# Altium project UNO MEDIA CARRIER.PrjPcb (part 1 of 2)
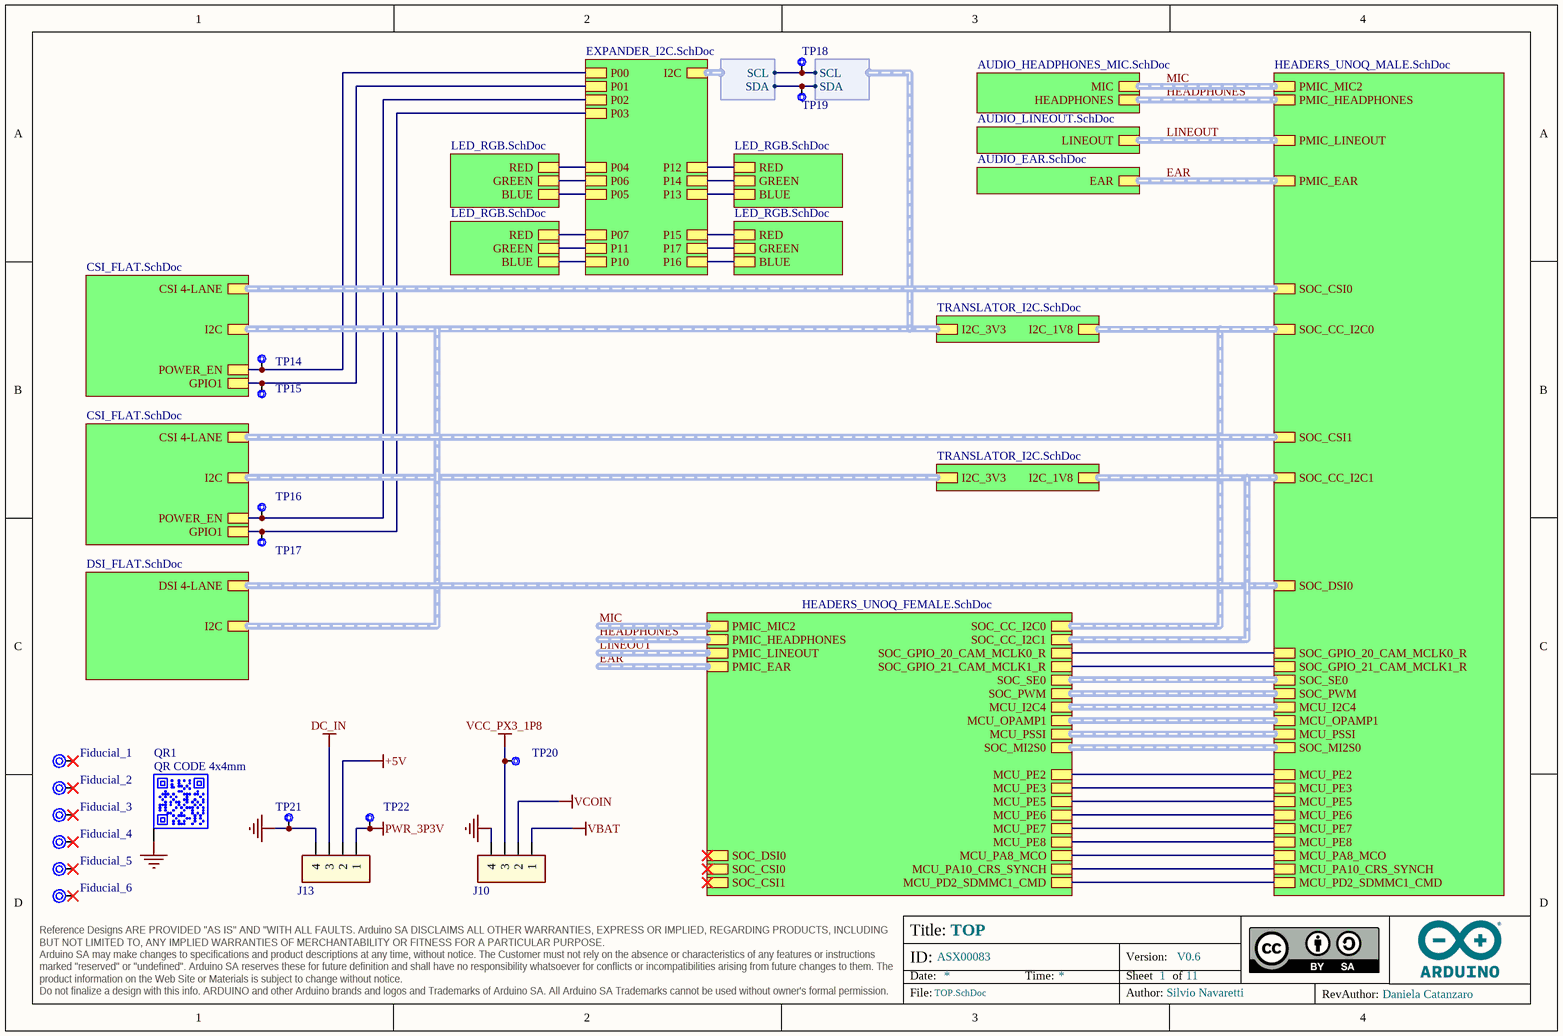
[diagram p0: TOP.SchDoc]
ASSEMBLY_BGA: _; ASSEMBLY_PRESSFIT: _; ASSEMBLY_SMD: X; ASSEMBLY_THT: _; BOARD_CODENAME: UNO Media Carrier; BOARD_INFO_AUTHOR: Silvio Navaretti; BOARD_INFO_AUTHOR_REV: Daniela Catanzaro; BOARD_INFO_Er: _; BOARD_INFO_FLEX: _; BOARD_INFO_FR4: X; BOARD_INFO_FR4_HTG: _; BOARD_INFO_IPC1: _; BOARD_INFO_IPC2: X; BOARD_INFO_IPC3: _; BOARD_INFO_IPC_NA: _; BOARD_INFO_NUMBER_OF_LAYERS: 4; BOARD_INFO_PCB_SIZE: 68.58x53.34mm; BOARD_INFO_POLYMIDE: _; BOARD_INFO_RIGID: X; BOARD_INFO_RIGID/FLEX: _; BOARD_INFO_TBD: _; BOARD_INFO_THICKNESS: 1.6mm; CODENAME: OCIO; DRILLS_BLIND: _; DRILLS_BURIED: _; DRILLS_COPPER_FILLING: _; DRILLS_FULL: X; DRILLS_LASER: _; DRILLS_PRESSFIT: _; DRILLS_RESIN_FILLING: _; DRILLS_SLOT: _; DRILLS_SOLDER_FILLING: X; FINISH_ADJUSTMENTS: _; FINISH_EDGE_PLATING: _; FINISH_ENIG: X; FINISH_HAL: _; FINISH_HAL_LF: -; FINISH_NI/AU: _; FINISH_SILK_BOTTOM: X; FINISH_SILK_COLOR: WHITE; FINISH_SILK_TOP: X; FINISH_SN/PB: _; FINISH_SOLDERMASK_BOTTOM: X; FINISH_SOLDERMASK_COLOR: BLUE; FINISH_SOLDERMASK_PEELABLE_BOTTOM: _; FINISH_SOLDERMASK_PEELABLE_COLOR: _; FINISH_SOLDERMASK_PEELABLE_TOP: _; FINISH_SOLDERMASK_TOP: X; FINISH_TABS: _; FINISH_TBD: _; INSULATION_MIN_INNER: 0.127mm; INSULATION_MIN_OUTER: 0.127mm; PANEL_MILLING: X; PANEL_NOT_REQUESTED: _; PANEL_NUMBER_OF_FIGURES: 8; PANEL_PROVIDED: X; PANEL_REQUESTED: _; PANEL_SCORING: X; PANEL_SIZE: 256x164mm; PANEL_TABS: _; SKU: ASX00083; TRACK_MIN_WIDTH_INNER: 0.127mm; TRACK_MIN_WIDTH_OUTER: 0.127mm; Version: V0.6; VIA_1: _; VIA_1_HOLE_MM: _; VIA_1_PAD_MM: _; VIA_2: _; VIA_2_HOLE_MM: _; VIA_2_PAD_MM: _; VIA_3: _; VIA_3_HOLE_MM: _; VIA_3_PAD_MM: _; VIA_4: _; VIA_4_HOLE_MM: _; VIA_4_PAD_MM: _; VIA_5: _; VIA_5_HOLE_MM: _; VIA_5_PAD_MM: _; VIA_THROUGH: X; VIA_THROUGH_HOLE_MM: 0.3; VIA_THROUGH_PAD_MM: 0.6
11 sheets, 95 parts. Net scope: hierarchical (ports join the sheet entries above them; power ports are global).
Board files: PCB.PcbDoc, PANEL.PcbDoc
Sheets:
  TOP.SchDoc
    U_HEADERS_IMOLA_MALE = HEADERS_UNOQ_MALE.SchDoc
    U_FLAT_CSI = CSI_FLAT.SchDoc
    U_TRANSLATOR_I2C = TRANSLATOR_I2C.SchDoc
    U_FLAT_CSI = CSI_FLAT.SchDoc
    U_TRANSLATOR_I2C = TRANSLATOR_I2C.SchDoc
    U_DSI_FLAT = DSI_FLAT.SchDoc
    U_AUDIO_EAR = AUDIO_EAR.SchDoc
    U_AUDIO_HEADPHONES_MIC = AUDIO_HEADPHONES_MIC.SchDoc
    U_AUDIO_LINEOUT = AUDIO_LINEOUT.SchDoc
    U_HEADERS_IMOLA_FEMALE = HEADERS_UNOQ_FEMALE.SchDoc
    U_Sheet1 = EXPANDER_I2C.SchDoc
    U_LED_RGB_1 = LED_RGB.SchDoc
    U_LED_RGB_2 = LED_RGB.SchDoc
    U_LED_RGB_3 = LED_RGB.SchDoc
    U_LED_RGB_4 = LED_RGB.SchDoc

## Sheet TOP.SchDoc: TOP
size A4; Author: Silvio Navaretti; CompanyName: Arduino SRL; DrawnBy: Silvio Navaretti; Engineer: Silvio Navaretti; Organization: Arduino SRL; DocumentNumber: ASX00083; SheetNumber: 1; SheetTotal: 11; RevAuthor: Silvio Navaretti

### Parts
Fiducial_1  Fiducial mark 1mm with 2mm solder  [Fiducial mark 1mm with circle-Footprint-1]  (value not drawn)  (no BOM)
Fiducial_2  Fiducial mark 1mm with 2mm solder  [Fiducial mark 1mm with circle-Footprint-1]  (value not drawn)  (no BOM)
Fiducial_3  Fiducial mark 1mm with 2mm solder  [Fiducial mark 1mm with circle-Footprint-1]  (value not drawn)  (no BOM)
Fiducial_4  Fiducial mark 1mm with 2mm solder  [Fiducial mark 1mm with circle-Footprint-1]  (value not drawn)  (no BOM)
Fiducial_5  Fiducial mark 1mm with 2mm solder  [Fiducial mark 1mm with circle-Footprint-1]  (value not drawn)  (no BOM)
Fiducial_6  Fiducial mark 1mm with 2mm solder  [Fiducial mark 1mm with circle-Footprint-1]  (value not drawn)  (no BOM)
J10  HEADER TH 2.54mm VERT. 1x004POS  [PIN HEADER 2.54mm VERT. 1x4POS-Footprint-1]  (value not drawn)  (no BOM)
J13  HEADER TH 2.54mm VERT. 1x004POS  [PIN HEADER 2.54mm VERT. 1x4POS-Footprint-1]  (value not drawn)  (no BOM)
QR1  QR CODE 4x4mm  [QR CODE 4x4mm]  (no BOM)
TP14  Test point 1.00mm  [TP-1.00MM]  (value not drawn)  (no BOM)
TP15  Test point 1.00mm  [TP-1.00MM]  (value not drawn)  (no BOM)
TP16  Test point 1.00mm  [TP-1.00MM]  (value not drawn)  (no BOM)
TP17  Test point 1.00mm  [TP-1.00MM]  (value not drawn)  (no BOM)
TP18  Test point 1.00mm  [TP-1.00MM]  (value not drawn)  (no BOM)
TP19  Test point 1.00mm  [TP-1.00MM]  (value not drawn)  (no BOM)
TP20  Test point 1.00mm  [TP-1.00MM]  (value not drawn)  (no BOM)
TP21  Test point 1.00mm  [TP-1.00MM]  (value not drawn)  (no BOM)
TP22  Test point 1.00mm  [TP-1.00MM]  (value not drawn)  (no BOM)

### Sub-sheets
U_AUDIO_EAR = AUDIO_EAR.SchDoc: EAR (harness EAR)
U_AUDIO_HEADPHONES_MIC = AUDIO_HEADPHONES_MIC.SchDoc: MIC (harness MIC), HEADPHONES (harness HEADPHONES)
U_AUDIO_LINEOUT = AUDIO_LINEOUT.SchDoc: LINEOUT (harness LINEOUT)
U_DSI_FLAT = DSI_FLAT.SchDoc: I2C (harness I2C), DSI 4-LANE (harness SOC_GPIO)
U_FLAT_CSI = CSI_FLAT.SchDoc: I2C (harness I2C), CSI 4-LANE (harness IMOLA_CSI), POWER_EN, GPIO1
U_FLAT_CSI = CSI_FLAT.SchDoc: I2C (harness I2C), CSI 4-LANE (harness IMOLA_CSI), POWER_EN, GPIO1
U_HEADERS_IMOLA_FEMALE = HEADERS_UNOQ_FEMALE.SchDoc: SOC_CSI0 (harness IMOLA_CSI), SOC_GPIO_20_CAM_MCLK0_R, SOC_CC_I2C1 (harness I2C), SOC_CSI1 (harness IMOLA_CSI), SOC_GPIO_21_CAM_MCLK1_R, SOC_CC_I2C0 (harness I2C), SOC_DSI0 (harness IMOLA_DSI), MCU_PSSI (harness PSSI_MCU), PMIC_MIC2 (harness MIC), MCU_PD2_SDMMC1_CMD, MCU_I2C4 (harness I2C), MCU_OPAMP1 (harness MCU_OPAMP), PMIC_LINEOUT (harness LINEOUT), PMIC_HEADPHONES (harness HEADPHONES), SOC_PWM (harness SOC_PWM), SOC_SE0 (harness SOC_GPIO), MCU_PA10_CRS_SYNCH, MCU_PA8_MCO, MCU_PE7, MCU_PE8, PMIC_EAR (harness EAT), SOC_MI2S0 (harness SOC_I2S), MCU_PE2, MCU_PE3, MCU_PE5, MCU_PE6
U_HEADERS_IMOLA_MALE = HEADERS_UNOQ_MALE.SchDoc: SOC_CSI0 (harness IMOLA_CSI), SOC_GPIO_20_CAM_MCLK0_R, SOC_CC_I2C1 (harness I2C), SOC_CSI1 (harness IMOLA_CSI), SOC_GPIO_21_CAM_MCLK1_R, SOC_CC_I2C0 (harness I2C), SOC_DSI0 (harness IMOLA_DSI), MCU_PSSI (harness PSSI_MCU), PMIC_MIC2 (harness MIC), MCU_PD2_SDMMC1_CMD, MCU_I2C4 (harness I2C), MCU_OPAMP1 (harness MCU_OPAMP), PMIC_LINEOUT (harness LINEOUT), PMIC_HEADPHONES (harness HEADPHONES), SOC_PWM (harness SOC_PWM), SOC_SE0 (harness SOC_GPIO), MCU_PA10_CRS_SYNCH, MCU_PA8_MCO, MCU_PE7, MCU_PE8, PMIC_EAR (harness EAT), SOC_MI2S0 (harness SOC_I2S), MCU_PE2, MCU_PE3, MCU_PE5, MCU_PE6
U_LED_RGB_1 = LED_RGB.SchDoc: GREEN, BLUE, RED
U_LED_RGB_2 = LED_RGB.SchDoc: GREEN, BLUE, RED
U_LED_RGB_3 = LED_RGB.SchDoc: GREEN, BLUE, RED
U_LED_RGB_4 = LED_RGB.SchDoc: GREEN, BLUE, RED
U_Sheet1 = EXPANDER_I2C.SchDoc: I2C (harness I2C), P00, P01, P02, P03, P04, P05, P06, P07, P10, P11, P12, P13, P14, P15, P16, P17
U_TRANSLATOR_I2C = TRANSLATOR_I2C.SchDoc: I2C_3V3 (harness I2C), I2C_1V8 (harness I2C)
U_TRANSLATOR_I2C = TRANSLATOR_I2C.SchDoc: I2C_3V3 (harness I2C), I2C_1V8 (harness I2C)

### Harnesses
I2C: SDA, SCL

### Nets
+5V: J13.2
DC_IN: J13.3
GND: J10.4 J13.4 QR1.PAD TP21.X
PWR_3P3V: J13.1 TP22.X
VBAT: J10.1
VCC_PX3_1P8: J10.3 TP20.X
VCOIN: J10.2
NetJ3_1_17: TP16.X ; sheet U_FLAT_CSI/POWER_EN, sheet U_Sheet1/P02
NetJ3_1_18: TP17.X ; sheet U_FLAT_CSI/GPIO1, sheet U_Sheet1/P03
NetJ3_2_17: TP14.X ; sheet U_FLAT_CSI/POWER_EN, sheet U_Sheet1/P00
NetJ3_2_18: TP15.X ; sheet U_FLAT_CSI/GPIO1, sheet U_Sheet1/P01
NetJ3_2_20: TP18.X ; sheet U_Sheet1/I2C.SCL, sheet U_FLAT_CSI/I2C.SCL
NetJ3_2_21: TP19.X ; sheet U_Sheet1/I2C.SDA, sheet U_FLAT_CSI/I2C.SDA
NetJ8_16: sheet U_HEADERS_IMOLA_MALE/SOC_GPIO_20_CAM_MCLK0_R, sheet U_HEADERS_IMOLA_FEMALE/SOC_GPIO_20_CAM_MCLK0_R
NetJ8_18: sheet U_HEADERS_IMOLA_MALE/SOC_GPIO_21_CAM_MCLK1_R, sheet U_HEADERS_IMOLA_FEMALE/SOC_GPIO_21_CAM_MCLK1_R
NetJ9_2: sheet U_HEADERS_IMOLA_MALE/MCU_PD2_SDMMC1_CMD, sheet U_HEADERS_IMOLA_FEMALE/MCU_PD2_SDMMC1_CMD
NetJ9_4: sheet U_HEADERS_IMOLA_MALE/MCU_PE2, sheet U_HEADERS_IMOLA_FEMALE/MCU_PE2
NetJ9_6: sheet U_HEADERS_IMOLA_MALE/MCU_PE3, sheet U_HEADERS_IMOLA_FEMALE/MCU_PE3
NetJ9_8: sheet U_HEADERS_IMOLA_MALE/MCU_PE5, sheet U_HEADERS_IMOLA_FEMALE/MCU_PE5
NetJ9_10: sheet U_HEADERS_IMOLA_MALE/MCU_PE6, sheet U_HEADERS_IMOLA_FEMALE/MCU_PE6
NetJ9_12: sheet U_HEADERS_IMOLA_MALE/MCU_PE7, sheet U_HEADERS_IMOLA_FEMALE/MCU_PE7
NetJ9_14: sheet U_HEADERS_IMOLA_MALE/MCU_PE8, sheet U_HEADERS_IMOLA_FEMALE/MCU_PE8
NetJ9_23: sheet U_HEADERS_IMOLA_MALE/MCU_PA8_MCO, sheet U_HEADERS_IMOLA_FEMALE/MCU_PA8_MCO
NetJ9_25: sheet U_HEADERS_IMOLA_MALE/MCU_PA10_CRS_SYNCH, sheet U_HEADERS_IMOLA_FEMALE/MCU_PA10_CRS_SYNCH
NetR2_1_1: sheet U_Sheet1/P04, sheet U_LED_RGB_1/RED
NetR2_2_1: sheet U_Sheet1/P07, sheet U_LED_RGB_2/RED
NetR2_3_1: sheet U_Sheet1/P12, sheet U_LED_RGB_3/RED
NetR2_4_1: sheet U_Sheet1/P15, sheet U_LED_RGB_4/RED
NetR4_1_1: sheet U_Sheet1/P05, sheet U_LED_RGB_1/BLUE
NetR4_2_1: sheet U_Sheet1/P10, sheet U_LED_RGB_2/BLUE
NetR4_3_1: sheet U_Sheet1/P13, sheet U_LED_RGB_3/BLUE
NetR4_4_1: sheet U_Sheet1/P16, sheet U_LED_RGB_4/BLUE
NetR5_1_2: sheet U_Sheet1/P06, sheet U_LED_RGB_1/GREEN
NetR5_2_2: sheet U_Sheet1/P11, sheet U_LED_RGB_2/GREEN
NetR5_3_2: sheet U_Sheet1/P14, sheet U_LED_RGB_3/GREEN
NetR5_4_2: sheet U_Sheet1/P17, sheet U_LED_RGB_4/GREEN

Not connected (* = marked no-connect by the designer): Fiducial_1 1*; Fiducial_2 1*; Fiducial_3 1*; Fiducial_4 1*; Fiducial_5 1*; Fiducial_6 1*

### Buses and harness runs
harness EAR = sheet U_AUDIO_EAR/EAR = sheet U_HEADERS_IMOLA_MALE/PMIC_EAR
harness EAR = sheet U_HEADERS_IMOLA_FEMALE/PMIC_EAR
harness HEADPHONES = sheet U_AUDIO_HEADPHONES_MIC/HEADPHONES = sheet U_HEADERS_IMOLA_MALE/PMIC_HEADPHONES
harness HEADPHONES = sheet U_HEADERS_IMOLA_FEMALE/PMIC_HEADPHONES
harness LINEOUT = sheet U_AUDIO_LINEOUT/LINEOUT = sheet U_HEADERS_IMOLA_MALE/PMIC_LINEOUT
harness LINEOUT = sheet U_HEADERS_IMOLA_FEMALE/PMIC_LINEOUT
harness MIC = sheet U_AUDIO_HEADPHONES_MIC/MIC = sheet U_HEADERS_IMOLA_MALE/PMIC_MIC2
harness MIC = sheet U_HEADERS_IMOLA_FEMALE/PMIC_MIC2
harness sheet U_DSI_FLAT/DSI 4-LANE = sheet U_HEADERS_IMOLA_MALE/SOC_DSI0
harness sheet U_DSI_FLAT/I2C = sheet U_FLAT_CSI/I2C = sheet U_TRANSLATOR_I2C/I2C_3V3
harness sheet U_FLAT_CSI/CSI 4-LANE = sheet U_HEADERS_IMOLA_MALE/SOC_CSI0
harness sheet U_FLAT_CSI/CSI 4-LANE = sheet U_HEADERS_IMOLA_MALE/SOC_CSI1
harness sheet U_FLAT_CSI/I2C = sheet U_TRANSLATOR_I2C/I2C_3V3
harness sheet U_HEADERS_IMOLA_FEMALE/MCU_I2C4 = sheet U_HEADERS_IMOLA_MALE/MCU_I2C4
harness sheet U_HEADERS_IMOLA_FEMALE/MCU_OPAMP1 = sheet U_HEADERS_IMOLA_MALE/MCU_OPAMP1
harness sheet U_HEADERS_IMOLA_FEMALE/MCU_PSSI = sheet U_HEADERS_IMOLA_MALE/MCU_PSSI
harness sheet U_HEADERS_IMOLA_FEMALE/SOC_CC_I2C0 = sheet U_HEADERS_IMOLA_MALE/SOC_CC_I2C0 = sheet U_TRANSLATOR_I2C/I2C_1V8
harness sheet U_HEADERS_IMOLA_FEMALE/SOC_CC_I2C1 = sheet U_HEADERS_IMOLA_MALE/SOC_CC_I2C1 = sheet U_TRANSLATOR_I2C/I2C_1V8
harness sheet U_HEADERS_IMOLA_FEMALE/SOC_MI2S0 = sheet U_HEADERS_IMOLA_MALE/SOC_MI2S0
harness sheet U_HEADERS_IMOLA_FEMALE/SOC_PWM = sheet U_HEADERS_IMOLA_MALE/SOC_PWM
harness sheet U_HEADERS_IMOLA_FEMALE/SOC_SE0 = sheet U_HEADERS_IMOLA_MALE/SOC_SE0

### Notes on the sheet
- Title:
- ID:
- Date:
- Time:
- Version:
- Sheet
- of
- RevAuthor:
- Reference Designs ARE PROVIDED "AS IS" AND "WITH ALL FAULTS. Arduino SA DISCLAIMS ALL OTHER WARRANTIES, EXPRESS OR IMPLIED, REGARDING PRODUCTS, INCLUDING BUT NOT LIMITED TO, ANY IMPLIED WARRANTIES OF MERCHANTABILITY OR FITNESS FOR A PARTICULAR PURPOSE.
  Arduino SA may make changes to specifications and product descriptions at any time, without notice. The Customer must not rely on the absence or characteristics of any features or instructions marked "reserved" or "undefined". Arduino SA reserves these for future definition and shall have no responsibility whatsoever for conflicts or incompatibilities arising from future changes to them. The product information on the Web Site or Materials is subject to change without notice.
  Do not finalize a design with this info. ARDUINO and other Arduino brands and logos and Trademarks of Arduino SA. All Arduino SA Trademarks cannot be used without owner's formal permission.
- File:
- Author:

### Library data of the parts
Fiducial_1-Fiducial_6 = UT0024-A.6
J10 J13 = J0162-A.6: Code Arduino: J0162
QR1 = QR-0001-A.5: QR CODE 4x4mm on layer 34 (This is not a component); Code Arduino: QRCODE_4x4mm; Part Number: This is not a component; Manufacturer: This is not a component
TP14-TP22 = UT0013-A.6: Manufacturer: This is not a component; Source: ut.SchLib; Pin Count: 1; Design Item ID: CMP-018-0005-A.3; Part Number: This is not a component; Code Arduino: This is not a component

## Sheet HEADERS_UNOQ_MALE.SchDoc: HEADERS UNO Q MALE
size A3; Author: Silvio Navaretti; CompanyName: Arduino SRL; DrawnBy: Silvio Navaretti; Engineer: Silvio Navaretti; Organization: Arduino SRL; DocumentNumber: ASX00083; SheetNumber: 2; SheetTotal: 11; RevAuthor: Silvio Navaretti
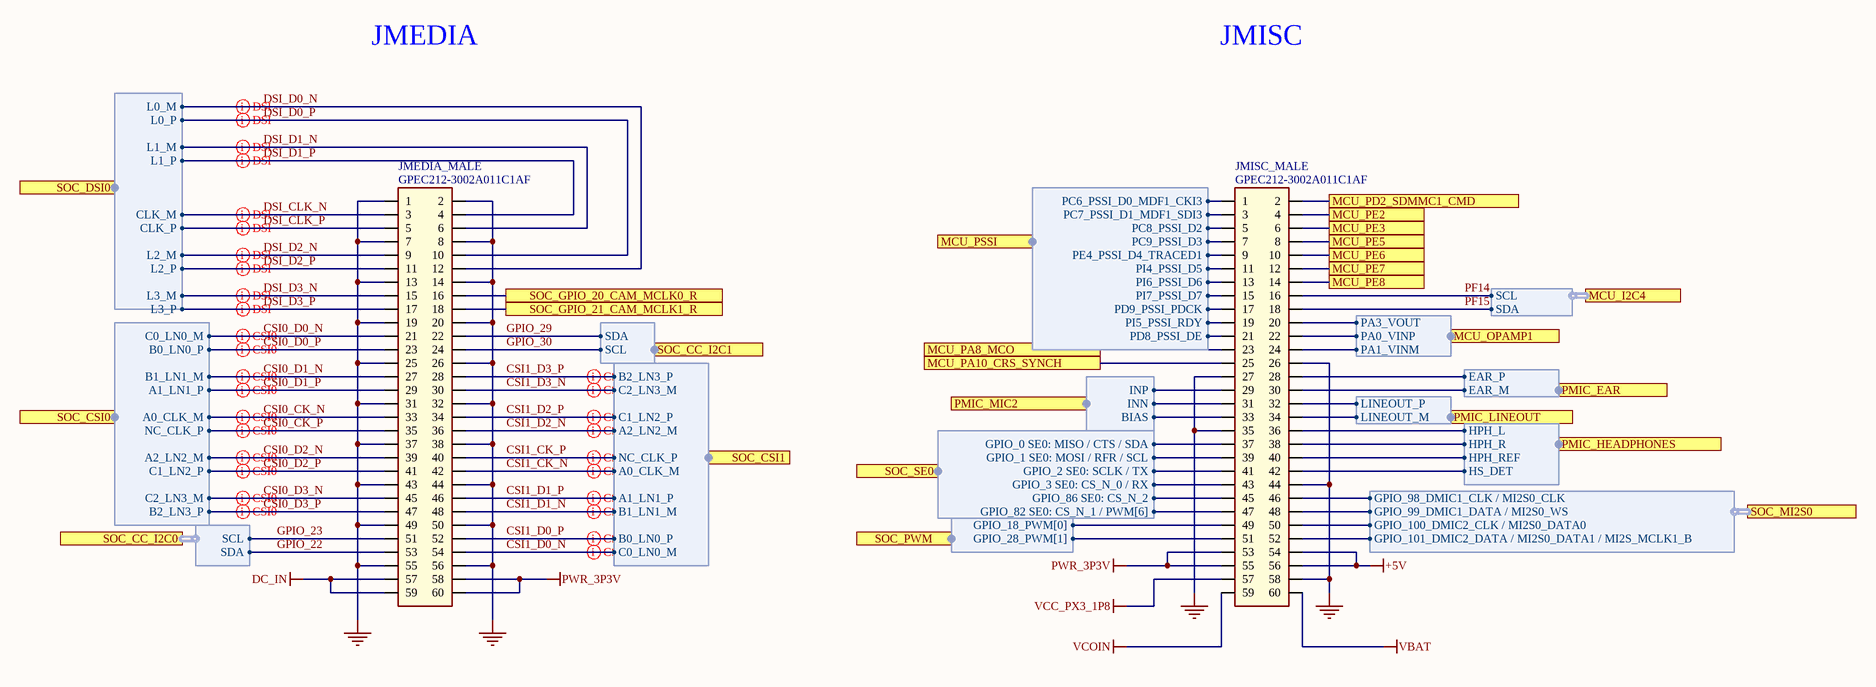
[diagram p1: HEADERS_UNOQ_MALE.SchDoc]

### Parts
JMEDIA_MALE  GPEC212-3002A011C1AF  [GPEC212-3002A011C1AF]
JMISC_MALE  GPEC212-3002A011C1AF  [GPEC212-3002A011C1AF]

### Ports
MCU_I2C4 (harness I2C), MCU_OPAMP1 (harness MCU_OPAMP), MCU_PA8_MCO, MCU_PA10_CRS_SYNCH, MCU_PD2_SDMMC1_CMD, MCU_PE2, MCU_PE3, MCU_PE5, MCU_PE6, MCU_PE7, MCU_PE8, MCU_PSSI (harness PSSI_MCU), PMIC_EAR (harness EAT), PMIC_HEADPHONES (harness HEADPHONES), PMIC_LINEOUT (harness LINEOUT), PMIC_MIC2 (harness MIC), SOC_CC_I2C0 (harness I2C), SOC_CC_I2C1 (harness I2C), SOC_CSI0 (harness IMOLA_CSI), SOC_CSI1 (harness IMOLA_CSI), SOC_DSI0 (harness IMOLA_DSI), SOC_GPIO_20_CAM_MCLK0_R, SOC_GPIO_21_CAM_MCLK1_R, SOC_MI2S0 (harness SOC_I2S), SOC_PWM (harness SOC_PWM), SOC_SE0 (harness SOC_GPIO)

### Harnesses
IMOLA_DSI: L1_P, L1_M, L3_P, L3_M, CLK_P, CLK_M, L0_P, L0_M, L2_P, L2_M
I2C: SDA, SCL
IMOLA_CSI: C2_LN3_M, A2_LN2_M, C1_LN2_P, C0_LN0_M, B0_LN0_P, A0_CLK_M, NC_CLK_P, B1_LN1_M, A1_LN1_P, B2_LN3_P
PSSI_MCU: PC6_PSSI_D0_MDF1_CKI3, PC7_PSSI_D1_MDF1_SDI3, PC8_PSSI_D2, PC9_PSSI_D3, PE4_PSSI_D4_TRACED1, PI4_PSSI_D5, PI6_PSSI_D6, PI7_PSSI_D7, PD9_PSSI_PDCK, PI5_PSSI_RDY, PD8_PSSI_DE
MCU_OPAMP: PA3_VOUT, PA0_VINP, PA1_VINM
EAT: EAR_P, EAR_M
MIC: INP, INN, BIAS
LINEOUT: LINEOUT_P, LINEOUT_M
HEADPHONES: HPH_L, HPH_R, HPH_REF, HS_DET
SOC_GPIO: GPIO_0 SE0: MISO / CTS / SDA, GPIO_1 SE0: MOSI / RFR / SCL, GPIO_2 SE0: SCLK / TX, GPIO_3 SE0: CS_N_0 / RX, GPIO_86 SE0: CS_N_2, GPIO_82 SE0: CS_N_1 / PWM[6]
SOC_I2S: GPIO_98_DMIC1_CLK / MI2S0_CLK, GPIO_99_DMIC1_DATA / MI2S0_WS, GPIO_100_DMIC2_CLK / MI2S0_DATA0, GPIO_101_DMIC2_DATA / MI2S0_DATA1 / MI2S_MCLK1_B
SOC_PWM: GPIO_18_PWM[0], GPIO_28_PWM[1]

### Nets
+5V: JMISC_MALE.54 JMISC_MALE.56
DC_IN: JMEDIA_MALE.57 JMEDIA_MALE.59
GND: JMEDIA_MALE.1 JMEDIA_MALE.2 JMEDIA_MALE.7 JMEDIA_MALE.8 JMEDIA_MALE.13 JMEDIA_MALE.14 JMEDIA_MALE.19 JMEDIA_MALE.20 JMEDIA_MALE.25 JMEDIA_MALE.26 JMEDIA_MALE.31 JMEDIA_MALE.32 JMEDIA_MALE.37 JMEDIA_MALE.38 JMEDIA_MALE.43 JMEDIA_MALE.44 JMEDIA_MALE.49 JMEDIA_MALE.50 JMEDIA_MALE.55 JMEDIA_MALE.56 JMISC_MALE.26 JMISC_MALE.27 JMISC_MALE.31 JMISC_MALE.35 JMISC_MALE.40 JMISC_MALE.44 JMISC_MALE.58 ; port PMIC_MIC2.INN, port PMIC_HEADPHONES.HPH_REF
PWR_3P3V: JMEDIA_MALE.58 JMEDIA_MALE.60 JMISC_MALE.53 JMISC_MALE.55
VBAT: JMISC_MALE.60
VCC_PX3_1P8: JMISC_MALE.57
VCOIN: JMISC_MALE.59
CSI0_CK_N: JMEDIA_MALE.33 ; port SOC_CSI0.A0_CLK_M
CSI0_CK_P: JMEDIA_MALE.35 ; port SOC_CSI0.NC_CLK_P
CSI0_D0_N: JMEDIA_MALE.21 ; port SOC_CSI0.C0_LN0_M
CSI0_D0_P: JMEDIA_MALE.23 ; port SOC_CSI0.B0_LN0_P
CSI0_D1_N: JMEDIA_MALE.27 ; port SOC_CSI0.B1_LN1_M
CSI0_D1_P: JMEDIA_MALE.29 ; port SOC_CSI0.A1_LN1_P
CSI0_D2_N: JMEDIA_MALE.39 ; port SOC_CSI0.A2_LN2_M
CSI0_D2_P: JMEDIA_MALE.41 ; port SOC_CSI0.C1_LN2_P
CSI0_D3_N: JMEDIA_MALE.45 ; port SOC_CSI0.C2_LN3_M
CSI0_D3_P: JMEDIA_MALE.47 ; port SOC_CSI0.B2_LN3_P
CSI1_CK_N: JMEDIA_MALE.42 ; port SOC_CSI1.A0_CLK_M
CSI1_CK_P: JMEDIA_MALE.40 ; port SOC_CSI1.NC_CLK_P
CSI1_D0_N: JMEDIA_MALE.54 ; port SOC_CSI1.C0_LN0_M
CSI1_D0_P: JMEDIA_MALE.52 ; port SOC_CSI1.B0_LN0_P
CSI1_D1_N: JMEDIA_MALE.48 ; port SOC_CSI1.B1_LN1_M
CSI1_D1_P: JMEDIA_MALE.46 ; port SOC_CSI1.A1_LN1_P
CSI1_D2_N: JMEDIA_MALE.36 ; port SOC_CSI1.A2_LN2_M
CSI1_D2_P: JMEDIA_MALE.34 ; port SOC_CSI1.C1_LN2_P
CSI1_D3_N: JMEDIA_MALE.30 ; port SOC_CSI1.C2_LN3_M
CSI1_D3_P: JMEDIA_MALE.28 ; port SOC_CSI1.B2_LN3_P
DSI_CLK_N: JMEDIA_MALE.3 ; port SOC_DSI0.CLK_M
DSI_CLK_P: JMEDIA_MALE.5 ; port SOC_DSI0.CLK_P
DSI_D0_N: JMEDIA_MALE.12 ; port SOC_DSI0.L0_M
DSI_D0_P: JMEDIA_MALE.10 ; port SOC_DSI0.L0_P
DSI_D1_N: JMEDIA_MALE.6 ; port SOC_DSI0.L1_M
DSI_D1_P: JMEDIA_MALE.4 ; port SOC_DSI0.L1_P
DSI_D2_N: JMEDIA_MALE.9 ; port SOC_DSI0.L2_M
DSI_D2_P: JMEDIA_MALE.11 ; port SOC_DSI0.L2_P
DSI_D3_N: JMEDIA_MALE.15 ; port SOC_DSI0.L3_M
DSI_D3_P: JMEDIA_MALE.17 ; port SOC_DSI0.L3_P
EAR.EAR_M: JMISC_MALE.30 ; port PMIC_EAR.EAR_M
EAR.EAR_P: JMISC_MALE.28 ; port PMIC_EAR.EAR_P
GPIO_22: JMEDIA_MALE.53 ; port SOC_CC_I2C0.SDA
GPIO_23: JMEDIA_MALE.51 ; port SOC_CC_I2C0.SCL
GPIO_29: JMEDIA_MALE.22 ; port SOC_CC_I2C1.SDA
GPIO_30: JMEDIA_MALE.24 ; port SOC_CC_I2C1.SCL
HEADPHONES.HPH_L: JMISC_MALE.36 ; port PMIC_HEADPHONES.HPH_L
HEADPHONES.HPH_R: JMISC_MALE.38 ; port PMIC_HEADPHONES.HPH_R
HEADPHONES.HS_DET: JMISC_MALE.42 ; port PMIC_HEADPHONES.HS_DET
LINEOUT.LINEOUT_M: JMISC_MALE.34 ; port PMIC_LINEOUT.LINEOUT_M
LINEOUT.LINEOUT_P: JMISC_MALE.32 ; port PMIC_LINEOUT.LINEOUT_P
MIC.BIAS: JMISC_MALE.33 ; port PMIC_MIC2.BIAS
MIC.INP: JMISC_MALE.29 ; port PMIC_MIC2.INP
PF14: JMISC_MALE.16 ; port MCU_I2C4.SCL
PF15: JMISC_MALE.18 ; port MCU_I2C4.SDA
NetJ8_16: JMEDIA_MALE.16 ; port SOC_GPIO_20_CAM_MCLK0_R
NetJ8_18: JMEDIA_MALE.18 ; port SOC_GPIO_21_CAM_MCLK1_R
NetJ9_1: JMISC_MALE.1 ; port MCU_PSSI.PC6_PSSI_D0_MDF1_CKI3
NetJ9_2: JMISC_MALE.2 ; port MCU_PD2_SDMMC1_CMD
NetJ9_3: JMISC_MALE.3 ; port MCU_PSSI.PC7_PSSI_D1_MDF1_SDI3
NetJ9_4: JMISC_MALE.4 ; port MCU_PE2
NetJ9_5: JMISC_MALE.5 ; port MCU_PSSI.PC8_PSSI_D2
NetJ9_6: JMISC_MALE.6 ; port MCU_PE3
NetJ9_7: JMISC_MALE.7 ; port MCU_PSSI.PC9_PSSI_D3
NetJ9_8: JMISC_MALE.8 ; port MCU_PE5
NetJ9_9: JMISC_MALE.9 ; port MCU_PSSI.PE4_PSSI_D4_TRACED1
NetJ9_10: JMISC_MALE.10 ; port MCU_PE6
NetJ9_11: JMISC_MALE.11 ; port MCU_PSSI.PI4_PSSI_D5
NetJ9_12: JMISC_MALE.12 ; port MCU_PE7
NetJ9_13: JMISC_MALE.13 ; port MCU_PSSI.PI6_PSSI_D6
NetJ9_14: JMISC_MALE.14 ; port MCU_PE8
NetJ9_15: JMISC_MALE.15 ; port MCU_PSSI.PI7_PSSI_D7
NetJ9_17: JMISC_MALE.17 ; port MCU_PSSI.PD9_PSSI_PDCK
NetJ9_19: JMISC_MALE.19 ; port MCU_PSSI.PI5_PSSI_RDY
NetJ9_20: JMISC_MALE.20 ; port MCU_OPAMP1.PA3_VOUT
NetJ9_21: JMISC_MALE.21 ; port MCU_PSSI.PD8_PSSI_DE
NetJ9_22: JMISC_MALE.22 ; port MCU_OPAMP1.PA0_VINP
NetJ9_23: JMISC_MALE.23 ; port MCU_PA8_MCO
NetJ9_24: JMISC_MALE.24 ; port MCU_OPAMP1.PA1_VINM
NetJ9_25: JMISC_MALE.25 ; port MCU_PA10_CRS_SYNCH
NetJ9_37: JMISC_MALE.37 ; port SOC_SE0.GPIO_0 SE0: MISO / CTS / SDA
NetJ9_39: JMISC_MALE.39 ; port SOC_SE0.GPIO_1 SE0: MOSI / RFR / SCL
NetJ9_41: JMISC_MALE.41 ; port SOC_SE0.GPIO_2 SE0: SCLK / TX
NetJ9_43: JMISC_MALE.43 ; port SOC_SE0.GPIO_3 SE0: CS_N_0 / RX
NetJ9_45: JMISC_MALE.45 ; port SOC_SE0.GPIO_86 SE0: CS_N_2
NetJ9_46: JMISC_MALE.46 ; port SOC_MI2S0.GPIO_98_DMIC1_CLK / MI2S0_CLK
NetJ9_47: JMISC_MALE.47 ; port SOC_SE0.GPIO_82 SE0: CS_N_1 / PWM[6]
NetJ9_48: JMISC_MALE.48 ; port SOC_MI2S0.GPIO_99_DMIC1_DATA / MI2S0_WS
NetJ9_49: JMISC_MALE.49 ; port SOC_PWM.GPIO_18_PWM[0]
NetJ9_50: JMISC_MALE.50 ; port SOC_MI2S0.GPIO_100_DMIC2_CLK / MI2S0_DATA0
NetJ9_51: JMISC_MALE.51 ; port SOC_PWM.GPIO_28_PWM[1]
NetJ9_52: JMISC_MALE.52 ; port SOC_MI2S0.GPIO_101_DMIC2_DATA / MI2S0_DATA1 / MI2S_MCLK1_B

### Layout directives
differential pair; differential pair class DSI; net class IMPEDANCE_100R: DSI_CLK_N, DSI_CLK_P, DSI_D0_N, DSI_D0_P, DSI_D1_N, DSI_D1_P, DSI_D2_N, DSI_D2_P, DSI_D3_N, DSI_D3_P
differential pair; differential pair class CSI0; net class IMPEDANCE_100R: CSI0_CK_N, CSI0_CK_P, CSI0_D0_N, CSI0_D0_P, CSI0_D1_N, CSI0_D1_P, CSI0_D2_N, CSI0_D2_P, CSI0_D3_N, CSI0_D3_P
differential pair; differential pair class CSI1; net class IMPEDANCE_100R: CSI1_CK_N, CSI1_CK_P, CSI1_D0_N, CSI1_D0_P, CSI1_D1_N, CSI1_D1_P, CSI1_D2_N, CSI1_D2_P, CSI1_D3_N, CSI1_D3_P

### Notes on the sheet
- JMEDIA
- JMISC
- Title:
- ID:
- Date:
- Time:
- Version:
- Sheet
- of
- RevAuthor:
- Reference Designs ARE PROVIDED "AS IS" AND "WITH ALL FAULTS. Arduino SA DISCLAIMS ALL OTHER WARRANTIES, EXPRESS OR IMPLIED, REGARDING PRODUCTS, INCLUDING BUT NOT LIMITED TO, ANY IMPLIED WARRANTIES OF MERCHANTABILITY OR FITNESS FOR A PARTICULAR PURPOSE.
  Arduino SA may make changes to specifications and product descriptions at any time, without notice. The Customer must not rely on the absence or characteristics of any features or instructions marked "reserved" or "undefined".
  Arduino SA reserves these for future definition and shall have no responsibility whatsoever for conflicts or incompatibilities arising from future changes to them. The product information on the Web Site or Materials is subject to change without notice.
  Do not finalize a design with this info. ARDUINO and other Arduino brands and logos and Trademarks of Arduino SA. All Arduino SA Trademarks cannot be used without owner's formal permission.
- File:
- Author:

### Library data of the parts
JMEDIA_MALE JMISC_MALE = J0568-A.3: CONN HEADER MALE VERTICAL SMD 1.27mm 2x30 POS lead heigth 3.5mm; Manufacturer: Greenconn; Code Arduino: J0568; Part Number: GPEC212-3002A011C1AF

## Sheet CSI_FLAT.SchDoc: CSI FLAT
size A4; Author: Silvio Navaretti; CompanyName: Arduino SRL; DrawnBy: Silvio Navaretti; Engineer: Silvio Navaretti; Organization: Arduino SRL; DocumentNumber: ASX00083; SheetNumber: 6; SheetTotal: 11; RevAuthor: Silvio Navaretti
Used 2 times, as channels U_FLAT_CSI, U_FLAT_CSI. Parts and nets are listed once, with the designators drawn on the sheet.
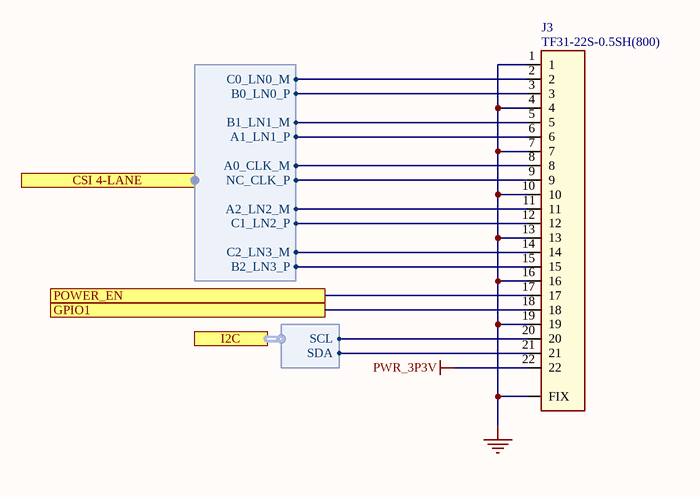
[diagram p2: CSI_FLAT.SchDoc]

### Parts
J3  TF31-22S-0.5SH(800)  [TF31-22S-0.5SH(800)]

### Ports
CSI 4-LANE (harness IMOLA_CSI), GPIO1, I2C (harness I2C), POWER_EN

### Harnesses
I2C: SDA, SCL
IMOLA_CSI: C2_LN3_M, A2_LN2_M, C1_LN2_P, C0_LN0_M, B0_LN0_P, A0_CLK_M, NC_CLK_P, B1_LN1_M, A1_LN1_P, B2_LN3_P

### Nets
GND: J3.1 J3.4 J3.7 J3.10 J3.13 J3.16 J3.19 J3.FIX
PWR_3P3V: J3.22
GPIO1: J3.18 ; port GPIO1
POWER_EN: J3.17 ; port POWER_EN
NetJ3_2: J3.2 ; port CSI 4-LANE.C0_LN0_M
NetJ3_3: J3.3 ; port CSI 4-LANE.B0_LN0_P
NetJ3_5: J3.5 ; port CSI 4-LANE.B1_LN1_M
NetJ3_6: J3.6 ; port CSI 4-LANE.A1_LN1_P
NetJ3_8: J3.8 ; port CSI 4-LANE.A0_CLK_M
NetJ3_9: J3.9 ; port CSI 4-LANE.NC_CLK_P
NetJ3_11: J3.11 ; port CSI 4-LANE.A2_LN2_M
NetJ3_12: J3.12 ; port CSI 4-LANE.C1_LN2_P
NetJ3_14: J3.14 ; port CSI 4-LANE.C2_LN3_M
NetJ3_15: J3.15 ; port CSI 4-LANE.B2_LN3_P
NetJ3_20: J3.20 ; port I2C.SCL
NetJ3_21: J3.21 ; port I2C.SDA

### Channels
U_FLAT_CSI: designators end in _2; ports GPIO1=NetJ3_2_18 POWER_EN=NetJ3_2_17
U_FLAT_CSI: designators end in _1; ports GPIO1=NetJ3_1_18 POWER_EN=NetJ3_1_17

### Library data of the parts
J3 = J0553-A.2: CONN FFC/FPC Connector, 22 Contact(s), 1 Row(s), BOTTOM CONTACT, Female, Right Angle, 0.5mm Pitch; Manufacturer: Hirose; Code Arduino: J0553; Part Number: TF31-22S-0.5SH(800)

## Sheet TRANSLATOR_I2C.SchDoc: TRANSLATOR I2C
size A4; Author: Silvio Navaretti; CompanyName: ARDUINO SRL; DrawnBy: Silvio Navaretti; Engineer: Silvio Navaretti; Organization: ARDUINO SRL; DocumentNumber: ASX00083; SheetNumber: 4; SheetTotal: 11; RevAuthor: Silvio Navaretti
Used 2 times, as channels U_TRANSLATOR_I2C, U_TRANSLATOR_I2C. Parts and nets are listed once, with the designators drawn on the sheet.
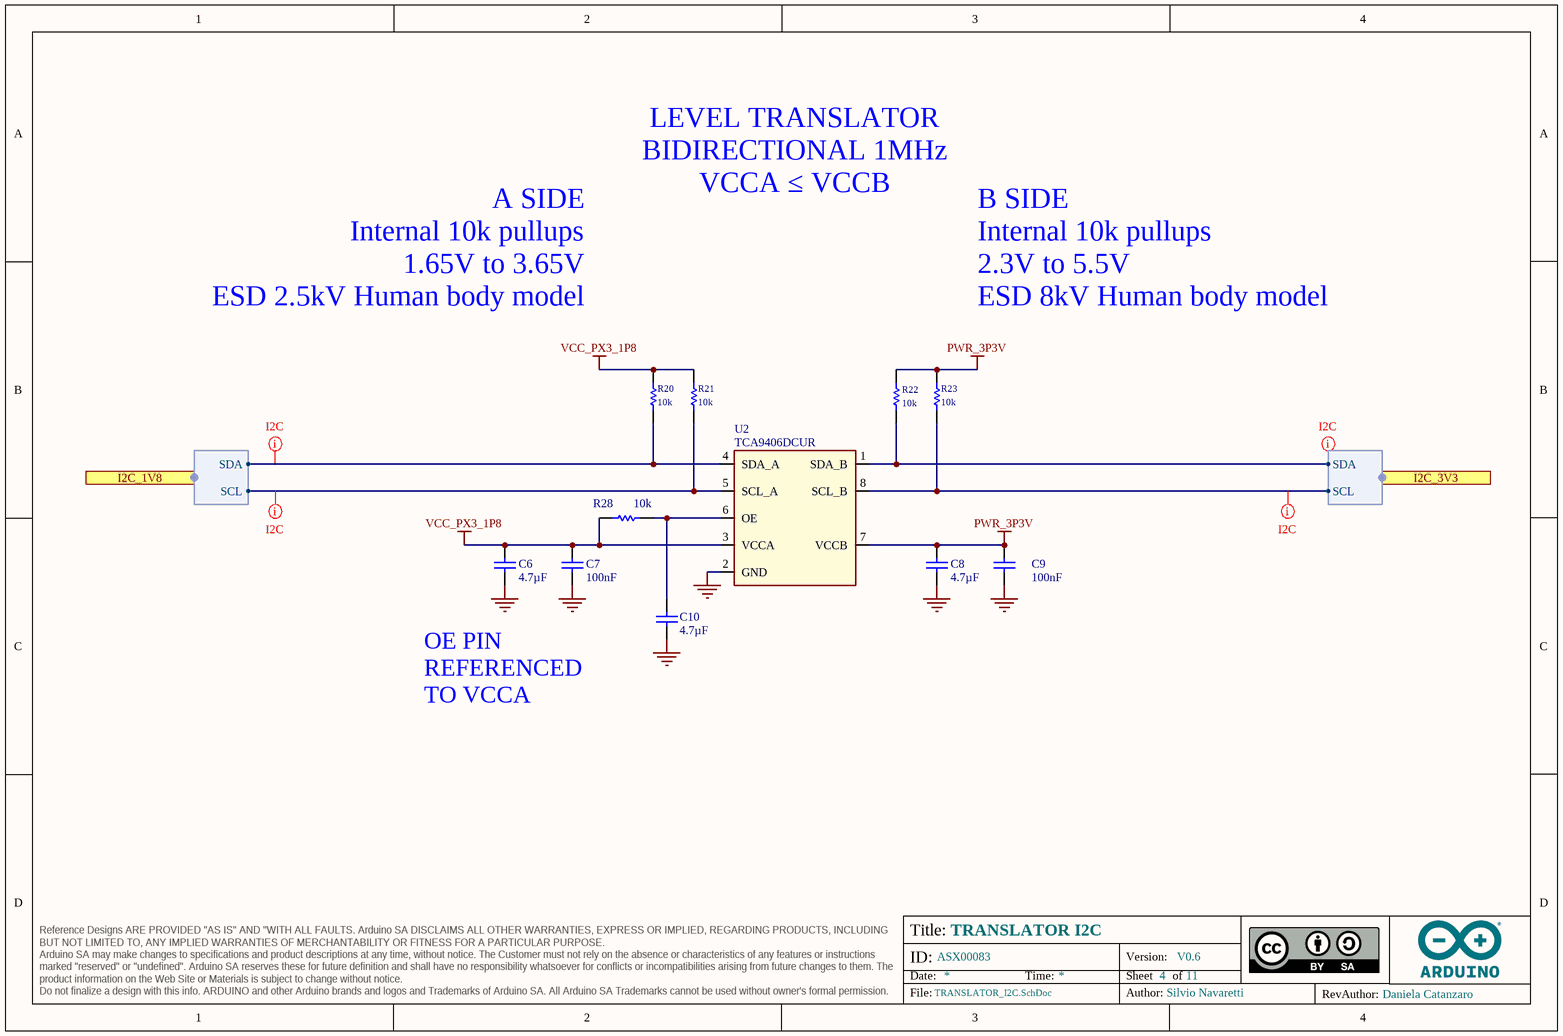
[diagram p3: TRANSLATOR_I2C.SchDoc]

### Parts
C6  value 4.7µF  [CAP-0402]  (hidden comment: C1005A475M6R3NT)
C7  value 100nF  [CAP-0402]  (hidden comment: GRM155R61H104KE19D)
C8  value 4.7µF  [CAP-0402]  (hidden comment: C1005A475M6R3NT)
C9  value 100nF  [CAP-0402]  (hidden comment: GRM155R61H104KE19D)
C10  value 4.7µF  [CAP-0402]  (hidden comment: C1005A475M6R3NT)
R20  value 10k  [RES-0402]  (hidden comment: CRCW040210K0FKED)
R21  value 10k  [RES-0402]  (hidden comment: CRCW040210K0FKED)
R22  value 10k  [RES-0402]  (hidden comment: CRCW040210K0FKED)
R23  value 10k  [RES-0402]  (hidden comment: CRCW040210K0FKED)
R28  value 10k  [RES-0402]  (hidden comment: CRCW040210K0FKED)
U2  TCA9406DCUR  [VSSOP8 pitch 0.5mm body 3.1x2x0.9mm]

### Ports
I2C_1V8 (harness I2C), I2C_3V3 (harness I2C)

### Harnesses
I2C: SDA, SCL

### Nets
GND: C6.1 C7.2 C8.1 C9.2 C10.1 U2.2(GND)
PWR_3P3V: C8.2 C9.1 R22.2 R23.2 U2.7(VCCB)
VCC_PX3_1P8: C6.2 C7.1 R20.2 R21.2 R28.2 U2.3(VCCA)
NetC10_2: C10.2 R28.1 U2.6(OE)
NetR20_1: R20.1 U2.4(SDA_A) ; port I2C_1V8.SDA
NetR21_1: R21.1 U2.5(SCL_A) ; port I2C_1V8.SCL
NetR22_1: R22.1 U2.1(SDA_B) ; port I2C_3V3.SDA
NetR23_1: R23.1 U2.8(SCL_B) ; port I2C_3V3.SCL

### Channels
U_TRANSLATOR_I2C: designators end in _2
U_TRANSLATOR_I2C: designators end in _1

### Layout directives
net class I2C: GPIO_22, GPIO_23, NetJ3_2_20, NetJ3_2_21

### Notes on the sheet
- LEVEL TRANSLATOR
  BIDIRECTIONAL 1MHz
  VCCA ≤ VCCB
- A SIDE
  Internal 10k pullups
  1.65V to 3.65V
  ESD 2.5kV Human body model
- B SIDE
  Internal 10k pullups
  2.3V to 5.5V
  ESD 8kV Human body model
- OE PIN REFERENCED TO VCCA
- Title:
- ID:
- Date:
- Time:
- Version:
- Sheet
- of
- RevAuthor:
- Reference Designs ARE PROVIDED "AS IS" AND "WITH ALL FAULTS. Arduino SA DISCLAIMS ALL OTHER WARRANTIES, EXPRESS OR IMPLIED, REGARDING PRODUCTS, INCLUDING BUT NOT LIMITED TO, ANY IMPLIED WARRANTIES OF MERCHANTABILITY OR FITNESS FOR A PARTICULAR PURPOSE.
  Arduino SA may make changes to specifications and product descriptions at any time, without notice. The Customer must not rely on the absence or characteristics of any features or instructions marked "reserved" or "undefined". Arduino SA reserves these for future definition and shall have no responsibility whatsoever for conflicts or incompatibilities arising from future changes to them. The product information on the Web Site or Materials is subject to change without notice.
  Do not finalize a design with this info. ARDUINO and other Arduino brands and logos and Trademarks of Arduino SA. All Arduino SA Trademarks cannot be used without owner's formal permission.
- File:
- Author:

### Library data of the parts
C6 C8 C10 = C0037-A.14: CAP CHIP 0402 4.7uF 20% 6V3 X5R; Manufacturer: Hottech; Code Arduino: 0833; Voltage: 6.3V; Dielectric: X5R; Technology: Ceramic; Part Number: C1005A475M6R3NT; Manufacturer 2: Samsung Electro-Mechanics; Case Code (Imperial): 0402; Tolerance: 20%; Manufacturer 3: Murata Electronics; Part number 3: GRM155R60J475ME47D; Part number 2: CL05A475KQ5NRNC
C7 C9 = C0015-A.14: CAP CHIP 0402 100nF 10% 50V X5R; Manufacturer: Murata; Code Arduino: A5141; Dielectric: X5R; Part Number: GRM155R61H104KE19D; Tolerance: 10%; Voltage: 50V; Case Code (Imperial): 0402; Technology: Ceramic
R20-R23 R28 = R0003-A.24: RES CHIP 0402 10k 1% 1/16W; Manufacturer: Vishay; Code Arduino: 0136; Power: 62.5mW; Temperature coefficient: 100ppm; Case Code (Imperial): 0402; Part Number: CRCW040210K0FKED; Technology: Thick film; Tolerance: 1%
U2 = U0087-A.10: IC Translator 2b,  Push pull, OE, VCCA 1.65V to 3.6V, VCCB 2.3V to 5.5V, internal 10k pullups, Iq 2uA when VCCA or VCCB at 0V, VSSOP8 3.1x2x0.9mm; Manufacturer: Texas Instruments; Code Arduino: A5381; Part Number: TCA9406DCUR; LCSC Part #: C840107

## Sheet DSI_FLAT.SchDoc: DSI FLAT
size A4; Author: Silvio Navaretti; CompanyName: Arduino SRL; DrawnBy: Silvio Navaretti; Engineer: Silvio Navaretti; Organization: Arduino SRL; DocumentNumber: ASX00083; SheetNumber: 7; SheetTotal: 11; RevAuthor: Silvio Navaretti
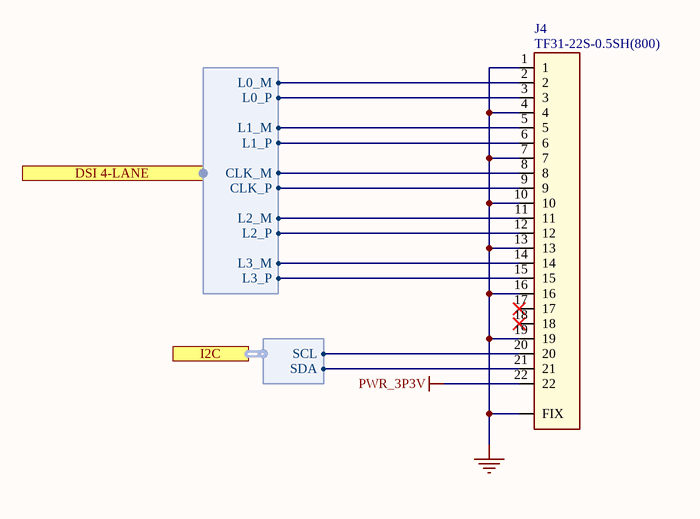
[diagram p4: DSI_FLAT.SchDoc]

### Parts
J4  TF31-22S-0.5SH(800)  [TF31-22S-0.5SH(800)]

### Ports
DSI 4-LANE (harness IMOLA_DSI), I2C (harness I2C)

### Harnesses
I2C: SDA, SCL
IMOLA_DSI: L1_P, L1_M, L3_P, L3_M, CLK_P, CLK_M, L0_P, L0_M, L2_P, L2_M

### Nets
GND: J4.1 J4.4 J4.7 J4.10 J4.13 J4.16 J4.19 J4.FIX
PWR_3P3V: J4.22
DSI_CLK_N: J4.8 ; port DSI 4-LANE.CLK_M
DSI_CLK_P: J4.9 ; port DSI 4-LANE.CLK_P
DSI_D0_N: J4.2 ; port DSI 4-LANE.L0_M
DSI_D0_P: J4.3 ; port DSI 4-LANE.L0_P
DSI_D1_N: J4.5 ; port DSI 4-LANE.L1_M
DSI_D1_P: J4.6 ; port DSI 4-LANE.L1_P
DSI_D2_N: J4.11 ; port DSI 4-LANE.L2_M
DSI_D2_P: J4.12 ; port DSI 4-LANE.L2_P
DSI_D3_N: J4.14 ; port DSI 4-LANE.L3_M
DSI_D3_P: J4.15 ; port DSI 4-LANE.L3_P
NetJ3_2_20: J4.20 ; port I2C.SCL
NetJ3_2_21: J4.21 ; port I2C.SDA

Not connected (* = marked no-connect by the designer): J4 17* 18*

### Notes on the sheet
- Title:
- ID:
- Date:
- Time:
- Version:
- Sheet
- of
- RevAuthor:
- Reference Designs ARE PROVIDED "AS IS" AND "WITH ALL FAULTS. Arduino SA DISCLAIMS ALL OTHER WARRANTIES, EXPRESS OR IMPLIED, REGARDING PRODUCTS, INCLUDING BUT NOT LIMITED TO, ANY IMPLIED WARRANTIES OF MERCHANTABILITY OR FITNESS FOR A PARTICULAR PURPOSE.
  Arduino SA may make changes to specifications and product descriptions at any time, without notice. The Customer must not rely on the absence or characteristics of any features or instructions marked "reserved" or "undefined". Arduino SA reserves these for future definition and shall have no responsibility whatsoever for conflicts or incompatibilities arising from future changes to them. The product information on the Web Site or Materials is subject to change without notice.
  Do not finalize a design with this info. ARDUINO and other Arduino brands and logos and Trademarks of Arduino SA. All Arduino SA Trademarks cannot be used without owner's formal permission.
- File:
- Author:

### Library data of the parts
J4 = J0553-A.2: as J3 on sheet CSI_FLAT; Part Number: TF31-22S-0.5SH(800)

## Sheet AUDIO_EAR.SchDoc: EAR OUT
size A4; Author: Silvio Navaretti; CompanyName: Arduino SRL; DrawnBy: Silvio Navaretti; Engineer: Silvio Navaretti; Organization: Arduino SRL; DocumentNumber: ASX00083; SheetNumber: 9; SheetTotal: 11; RevAuthor: Silvio Navaretti
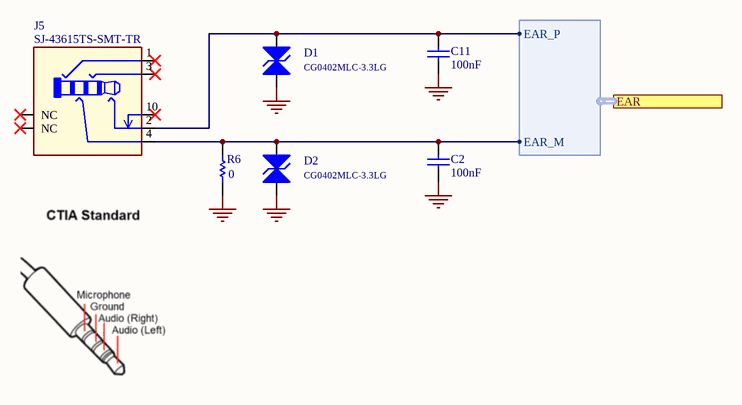
[diagram p5: AUDIO_EAR.SchDoc]

### Parts
C2  value 100nF  [CAP-0402]  (hidden comment: GRM155R61H104KE19D)
C11  value 100nF  [CAP-0402]  (hidden comment: GRM155R61H104KE19D)
D1  CG0402MLC-3.3LG  [0402]
D2  CG0402MLC-3.3LG  [0402]
J5  SJ-43615TS-SMT-TR  [SJ-43615TS-SMT-TR]
R6  value 0  [RES-0402]  (hidden comment: CRCW04020000Z0EDC)

### Ports
EAR (harness EAR)

### Harnesses
EAR: EAR_P, EAR_M

### Nets
GND: C2.1 C11.1 D1.A D2.A R6.1
EAR.EAR_M: C2.2 D2.C J5.4 R6.2 ; port EAR.EAR_M
EAR.EAR_P: C11.2 D1.C J5.2 ; port EAR.EAR_P

Not connected (* = marked no-connect by the designer): J5 1* 3* 10* 11(NC)* 12(NC)*

### Notes on the sheet
- Title:
- ID:
- Date:
- Time:
- Version:
- Sheet
- of
- RevAuthor:
- Reference Designs ARE PROVIDED "AS IS" AND "WITH ALL FAULTS. Arduino SA DISCLAIMS ALL OTHER WARRANTIES, EXPRESS OR IMPLIED, REGARDING PRODUCTS, INCLUDING BUT NOT LIMITED TO, ANY IMPLIED WARRANTIES OF MERCHANTABILITY OR FITNESS FOR A PARTICULAR PURPOSE.
  Arduino SA may make changes to specifications and product descriptions at any time, without notice. The Customer must not rely on the absence or characteristics of any features or instructions marked "reserved" or "undefined". Arduino SA reserves these for future definition and shall have no responsibility whatsoever for conflicts or incompatibilities arising from future changes to them. The product information on the Web Site or Materials is subject to change without notice.
  Do not finalize a design with this info. ARDUINO and other Arduino brands and logos and Trademarks of Arduino SA. All Arduino SA Trademarks cannot be used without owner's formal permission.
- File:
- Author:

### Library data of the parts
C2 C11 = C0015-A.14: as C7 on sheet TRANSLATOR_I2C; Part Number: GRM155R61H104KE19D; Dielectric: X5R; Tolerance: 10%; Technology: Ceramic; Voltage: 50V; Case Code (Imperial): 0402
D1 D2 = D0073-A.3: DIODE TVS SMD 0402 3.3V ESD PROTECTION; Manufacturer: Bourns; Code Arduino: D0073; Direction: Bidirectional; Part Number: CG0402MLC-3.3LG; Device Type: ESD protection; Datasheet: https://www.mouser.it/datasheet/2/54/MLC-777442.pdf
J5 = J0533-A.9: CONN Audio Jack 3.5mm, 4 conductor, tip switch, SMD mid mount; Manufacturer: Same Sky; Code Arduino: J0533; Part Number: SJ-43615TS-SMT-TR
R6 = R0000-A.24: RES CHIP 0402 0R 1/16W; Manufacturer: Vishay; Code Arduino: 0039; Power: 62.5mW; Tolerance: 0%; Temperature coefficient: 0ppm; Part Number: CRCW04020000Z0EDC; Technology: Thick film; Case Code (Imperial): 0402

## Sheet AUDIO_HEADPHONES_MIC.SchDoc: HEADPHONES OUT, MIC IN
size A4; Author: Silvio Navaretti; CompanyName: Arduino SRL; DrawnBy: Silvio Navaretti; Engineer: Silvio Navaretti; Organization: Arduino SRL; DocumentNumber: ASX00083; SheetNumber: 8; SheetTotal: 11; RevAuthor: Silvio Navaretti
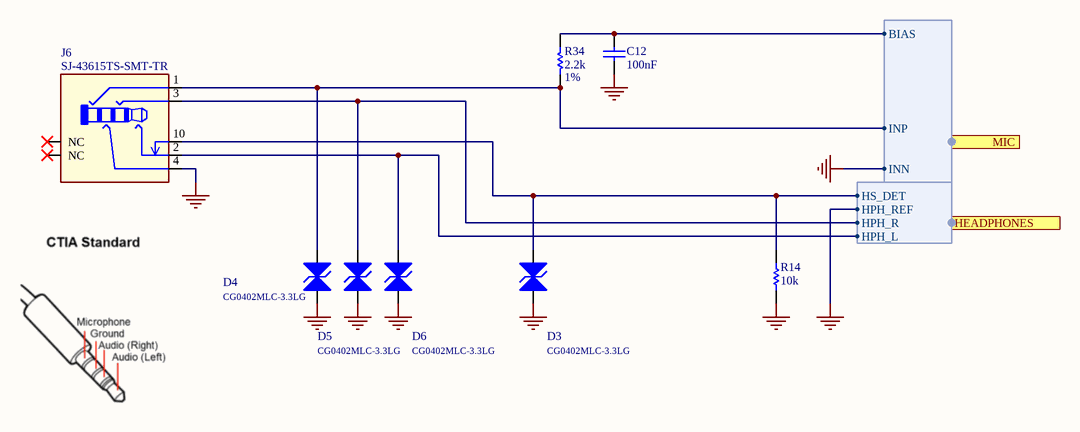
[diagram p6: AUDIO_HEADPHONES_MIC.SchDoc]

### Parts
C12  value 100nF  [CAP-0402]  (hidden comment: GRM155R61H104KE19D)
D3  CG0402MLC-3.3LG  [0402]
D4  CG0402MLC-3.3LG  [0402]
D5  CG0402MLC-3.3LG  [0402]
D6  CG0402MLC-3.3LG  [0402]
J6  SJ-43615TS-SMT-TR  [SJ-43615TS-SMT-TR]
R14  value 10k  [RES-0402]  (hidden comment: CRCW040210K0FKED)
R34  value 2.2k  Tolerance: 1%  [RES-0402]  (hidden comment: AF0402FR-072K2L)

### Ports
HEADPHONES (harness HEADPHONES), MIC (harness MIC)

### Harnesses
MIC: INP, INN, BIAS
HEADPHONES: HPH_L, HPH_R, HPH_REF, HS_DET

### Nets
GND: C12.1 D3.A D4.A D5.A D6.A J6.4 R14.1 ; port MIC.INN, port HEADPHONES.HPH_REF
HEADPHONES.HPH_L: D6.C J6.2 ; port HEADPHONES.HPH_L
HEADPHONES.HPH_R: D5.C J6.3 ; port HEADPHONES.HPH_R
HEADPHONES.HS_DET: D3.C J6.10 R14.2 ; port HEADPHONES.HS_DET
MIC.BIAS: C12.2 R34.1 ; port MIC.BIAS
MIC.INP: D4.C J6.1 R34.2 ; port MIC.INP

Not connected (* = marked no-connect by the designer): J6 11(NC)* 12(NC)*

### Notes on the sheet
- Title:
- ID:
- Date:
- Time:
- Version:
- Sheet
- of
- RevAuthor:
- Reference Designs ARE PROVIDED "AS IS" AND "WITH ALL FAULTS. Arduino SA DISCLAIMS ALL OTHER WARRANTIES, EXPRESS OR IMPLIED, REGARDING PRODUCTS, INCLUDING BUT NOT LIMITED TO, ANY IMPLIED WARRANTIES OF MERCHANTABILITY OR FITNESS FOR A PARTICULAR PURPOSE.
  Arduino SA may make changes to specifications and product descriptions at any time, without notice. The Customer must not rely on the absence or characteristics of any features or instructions marked "reserved" or "undefined". Arduino SA reserves these for future definition and shall have no responsibility whatsoever for conflicts or incompatibilities arising from future changes to them. The product information on the Web Site or Materials is subject to change without notice.
  Do not finalize a design with this info. ARDUINO and other Arduino brands and logos and Trademarks of Arduino SA. All Arduino SA Trademarks cannot be used without owner's formal permission.
- File:
- Author:

### Library data of the parts
C12 = C0015-A.14: as C7 on sheet TRANSLATOR_I2C; Part Number: GRM155R61H104KE19D; Dielectric: X5R; Tolerance: 10%; Technology: Ceramic; Voltage: 50V; Case Code (Imperial): 0402
D3-D6 = D0073-A.3: as D1 on sheet AUDIO_EAR; Part Number: CG0402MLC-3.3LG; Device Type: ESD protection; Datasheet: https://www.mouser.it/datasheet/2/54/MLC-777442.pdf
J6 = J0533-A.9: as J5 on sheet AUDIO_EAR; Part Number: SJ-43615TS-SMT-TR
R14 = R0003-A.24: as R20 on sheet TRANSLATOR_I2C; Case Code (Imperial): 0402; Part Number: CRCW040210K0FKED; Technology: Thick film; Tolerance: 1%
R34 = R0286-A.3: RES CHIP 0402 2k2 1% 1/16W; Manufacturer: Yageo; Temperature coefficient: 100ppm; Power: 62.5mW; Code Arduino: R0286; Technology: Thick film; Manufacturer 2: Hottech; Part Number 2: RI0402L2201FT; Part Number: AF0402FR-072K2L; Case Code (Imperial): 0402

## Sheet AUDIO_LINEOUT.SchDoc: LINE OUT
size A4; Author: Silvio Navaretti; CompanyName: Arduino SRL; DrawnBy: Silvio Navaretti; Engineer: Silvio Navaretti; Organization: Arduino SRL; DocumentNumber: ASX00083; SheetNumber: 10; SheetTotal: 11; RevAuthor: Silvio Navaretti
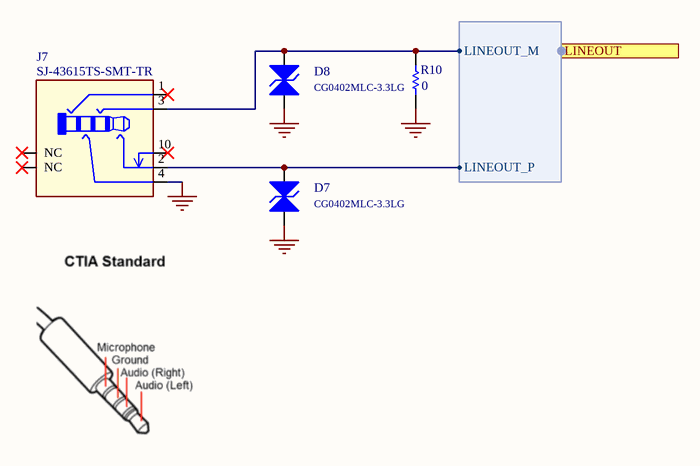
[diagram p7: AUDIO_LINEOUT.SchDoc]

### Parts
D7  CG0402MLC-3.3LG  [0402]
D8  CG0402MLC-3.3LG  [0402]
J7  SJ-43615TS-SMT-TR  [SJ-43615TS-SMT-TR]
R10  value 0  [RES-0402]  (hidden comment: CRCW04020000Z0EDC)

### Ports
LINEOUT (harness LINEOUT)

### Harnesses
LINEOUT: LINEOUT_P, LINEOUT_M

### Nets
GND: D7.A D8.A J7.4 R10.1
LINEOUT.LINEOUT_M: D8.C J7.3 R10.2 ; port LINEOUT.LINEOUT_M
LINEOUT.LINEOUT_P: D7.C J7.2 ; port LINEOUT.LINEOUT_P

Not connected (* = marked no-connect by the designer): J7 1* 10* 11(NC)* 12(NC)*

### Notes on the sheet
- Title:
- ID:
- Date:
- Time:
- Version:
- Sheet
- of
- RevAuthor:
- Reference Designs ARE PROVIDED "AS IS" AND "WITH ALL FAULTS. Arduino SA DISCLAIMS ALL OTHER WARRANTIES, EXPRESS OR IMPLIED, REGARDING PRODUCTS, INCLUDING BUT NOT LIMITED TO, ANY IMPLIED WARRANTIES OF MERCHANTABILITY OR FITNESS FOR A PARTICULAR PURPOSE.
  Arduino SA may make changes to specifications and product descriptions at any time, without notice. The Customer must not rely on the absence or characteristics of any features or instructions marked "reserved" or "undefined". Arduino SA reserves these for future definition and shall have no responsibility whatsoever for conflicts or incompatibilities arising from future changes to them. The product information on the Web Site or Materials is subject to change without notice.
  Do not finalize a design with this info. ARDUINO and other Arduino brands and logos and Trademarks of Arduino SA. All Arduino SA Trademarks cannot be used without owner's formal permission.
- File:
- Author:

### Library data of the parts
D7 D8 = D0073-A.3: as D1 on sheet AUDIO_EAR; Part Number: CG0402MLC-3.3LG; Device Type: ESD protection; Datasheet: https://www.mouser.it/datasheet/2/54/MLC-777442.pdf
J7 = J0533-A.9: as J5 on sheet AUDIO_EAR; Part Number: SJ-43615TS-SMT-TR
R10 = R0000-A.24: as R6 on sheet AUDIO_EAR; Part Number: CRCW04020000Z0EDC; Technology: Thick film; Case Code (Imperial): 0402

## Sheet HEADERS_UNOQ_FEMALE.SchDoc: HEADERS UNO Q FEMALE
size A3; Author: Silvio Navaretti; CompanyName: Arduino SRL; DrawnBy: Silvio Navaretti; Engineer: Silvio Navaretti; Organization: Arduino SRL; DocumentNumber: ASX00083; SheetNumber: 3; SheetTotal: 11; RevAuthor: Silvio Navaretti
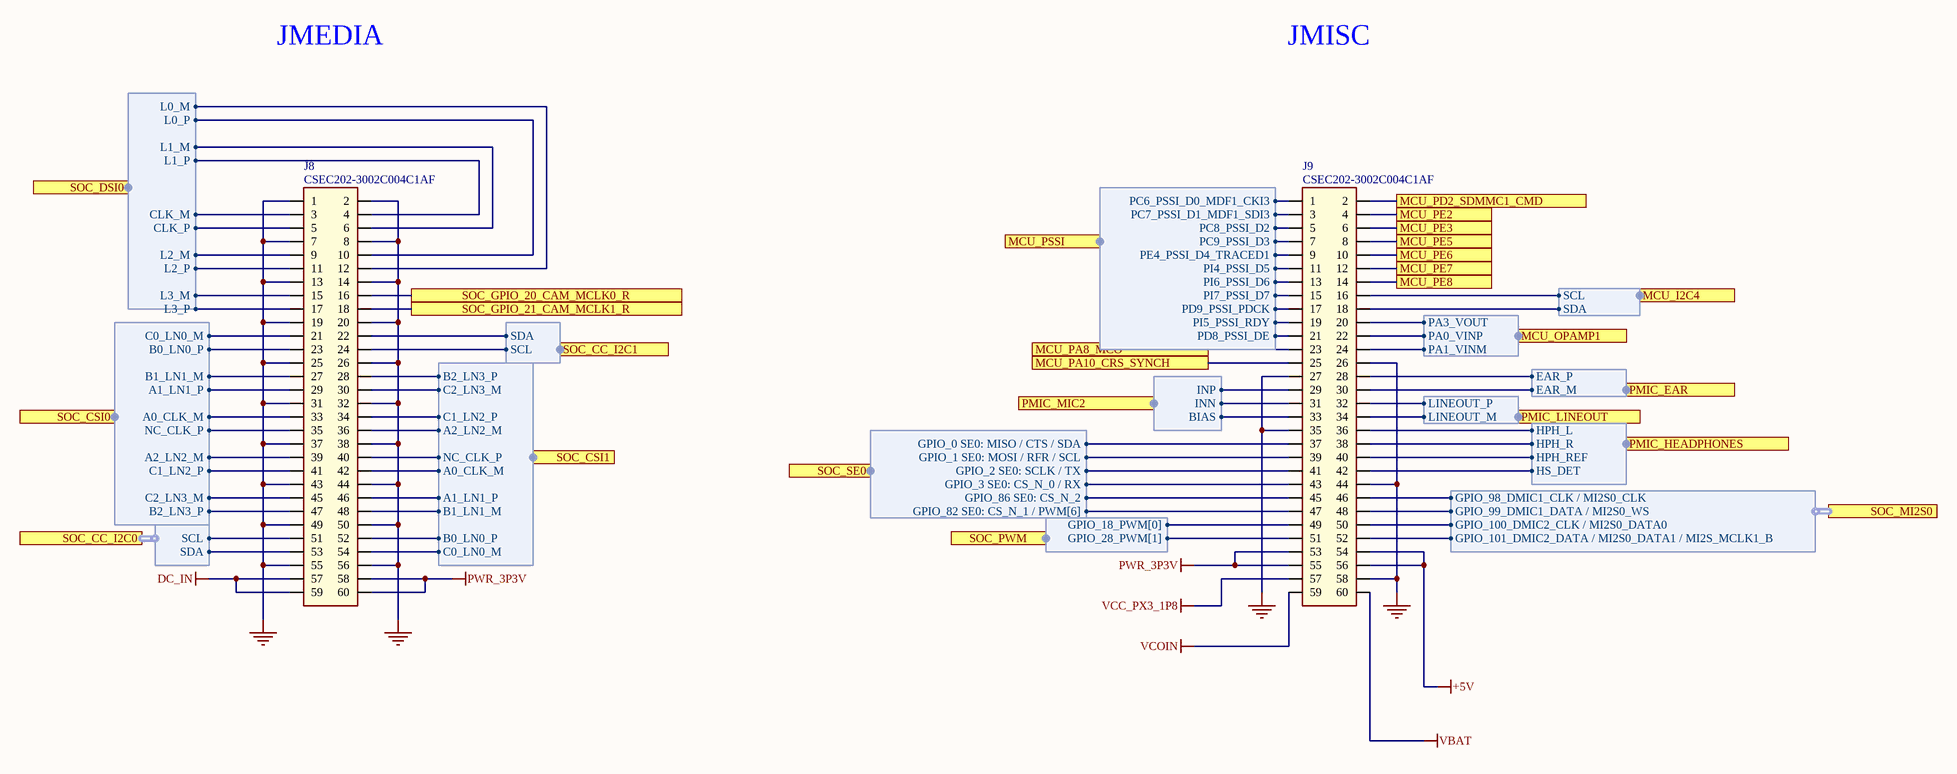
[diagram p8: HEADERS_UNOQ_FEMALE.SchDoc]

### Parts
J8  CSEC202-3002C004C1AF  [CSEC202-3002C004C1AF]
J9  CSEC202-3002C004C1AF  [CSEC202-3002C004C1AF]

### Ports
MCU_I2C4 (harness I2C), MCU_OPAMP1 (harness MCU_OPAMP), MCU_PA8_MCO, MCU_PA10_CRS_SYNCH, MCU_PD2_SDMMC1_CMD, MCU_PE2, MCU_PE3, MCU_PE5, MCU_PE6, MCU_PE7, MCU_PE8, MCU_PSSI (harness PSSI_MCU), PMIC_EAR (harness EAT), PMIC_HEADPHONES (harness HEADPHONES), PMIC_LINEOUT (harness LINEOUT), PMIC_MIC2 (harness MIC), SOC_CC_I2C0 (harness I2C), SOC_CC_I2C1 (harness I2C), SOC_CSI0 (harness IMOLA_CSI), SOC_CSI1 (harness IMOLA_CSI), SOC_DSI0 (harness IMOLA_DSI), SOC_GPIO_20_CAM_MCLK0_R, SOC_GPIO_21_CAM_MCLK1_R, SOC_MI2S0 (harness SOC_I2S), SOC_PWM (harness SOC_PWM), SOC_SE0 (harness SOC_GPIO)

### Harnesses
IMOLA_DSI: L1_P, L1_M, L3_P, L3_M, CLK_P, CLK_M, L0_P, L0_M, L2_P, L2_M
I2C: SDA, SCL
IMOLA_CSI: C2_LN3_M, A2_LN2_M, C1_LN2_P, C0_LN0_M, B0_LN0_P, A0_CLK_M, NC_CLK_P, B1_LN1_M, A1_LN1_P, B2_LN3_P
PSSI_MCU: PC6_PSSI_D0_MDF1_CKI3, PC7_PSSI_D1_MDF1_SDI3, PC8_PSSI_D2, PC9_PSSI_D3, PE4_PSSI_D4_TRACED1, PI4_PSSI_D5, PI6_PSSI_D6, PI7_PSSI_D7, PD9_PSSI_PDCK, PI5_PSSI_RDY, PD8_PSSI_DE
MCU_OPAMP: PA3_VOUT, PA0_VINP, PA1_VINM
EAT: EAR_P, EAR_M
MIC: INP, INN, BIAS
LINEOUT: LINEOUT_P, LINEOUT_M
HEADPHONES: HPH_L, HPH_R, HPH_REF, HS_DET
SOC_GPIO: GPIO_0 SE0: MISO / CTS / SDA, GPIO_1 SE0: MOSI / RFR / SCL, GPIO_2 SE0: SCLK / TX, GPIO_3 SE0: CS_N_0 / RX, GPIO_86 SE0: CS_N_2, GPIO_82 SE0: CS_N_1 / PWM[6]
SOC_PWM: GPIO_18_PWM[0], GPIO_28_PWM[1]
SOC_I2S: GPIO_98_DMIC1_CLK / MI2S0_CLK, GPIO_99_DMIC1_DATA / MI2S0_WS, GPIO_100_DMIC2_CLK / MI2S0_DATA0, GPIO_101_DMIC2_DATA / MI2S0_DATA1 / MI2S_MCLK1_B

### Nets
+5V: J9.54 J9.56
DC_IN: J8.57 J8.59
GND: J8.1 J8.2 J8.7 J8.8 J8.13 J8.14 J8.19 J8.20 J8.25 J8.26 J8.31 J8.32 J8.37 J8.38 J8.43 J8.44 J8.49 J8.50 J8.55 J8.56 J9.26 J9.27 J9.31 J9.35 J9.40 J9.44 J9.58 ; port PMIC_MIC2.INN, port PMIC_HEADPHONES.HPH_REF
PWR_3P3V: J8.58 J8.60 J9.53 J9.55
VBAT: J9.60
VCC_PX3_1P8: J9.57
VCOIN: J9.59
EAR.EAR_M: J9.30 ; port PMIC_EAR.EAR_M
EAR.EAR_P: J9.28 ; port PMIC_EAR.EAR_P
GPIO_22: J8.53 ; port SOC_CC_I2C0.SDA
GPIO_23: J8.51 ; port SOC_CC_I2C0.SCL
GPIO_29: J8.22 ; port SOC_CC_I2C1.SDA
GPIO_30: J8.24 ; port SOC_CC_I2C1.SCL
HEADPHONES.HPH_L: J9.36 ; port PMIC_HEADPHONES.HPH_L
HEADPHONES.HPH_R: J9.38 ; port PMIC_HEADPHONES.HPH_R
HEADPHONES.HS_DET: J9.42 ; port PMIC_HEADPHONES.HS_DET
LINEOUT.LINEOUT_M: J9.34 ; port PMIC_LINEOUT.LINEOUT_M
LINEOUT.LINEOUT_P: J9.32 ; port PMIC_LINEOUT.LINEOUT_P
MIC.BIAS: J9.33 ; port PMIC_MIC2.BIAS
MIC.INP: J9.29 ; port PMIC_MIC2.INP
PF14: J9.16 ; port MCU_I2C4.SCL
PF15: J9.18 ; port MCU_I2C4.SDA
NetJ8_3: J8.3 ; port SOC_DSI0.CLK_M
NetJ8_4: J8.4 ; port SOC_DSI0.L1_P
NetJ8_5: J8.5 ; port SOC_DSI0.CLK_P
NetJ8_6: J8.6 ; port SOC_DSI0.L1_M
NetJ8_9: J8.9 ; port SOC_DSI0.L2_M
NetJ8_10: J8.10 ; port SOC_DSI0.L0_P
NetJ8_11: J8.11 ; port SOC_DSI0.L2_P
NetJ8_12: J8.12 ; port SOC_DSI0.L0_M
NetJ8_15: J8.15 ; port SOC_DSI0.L3_M
NetJ8_16: J8.16 ; port SOC_GPIO_20_CAM_MCLK0_R
NetJ8_17: J8.17 ; port SOC_DSI0.L3_P
NetJ8_18: J8.18 ; port SOC_GPIO_21_CAM_MCLK1_R
NetJ8_21: J8.21 ; port SOC_CSI0.C0_LN0_M
NetJ8_23: J8.23 ; port SOC_CSI0.B0_LN0_P
NetJ8_27: J8.27 ; port SOC_CSI0.B1_LN1_M
NetJ8_28: J8.28 ; port SOC_CSI1.B2_LN3_P
NetJ8_29: J8.29 ; port SOC_CSI0.A1_LN1_P
NetJ8_30: J8.30 ; port SOC_CSI1.C2_LN3_M
NetJ8_33: J8.33 ; port SOC_CSI0.A0_CLK_M
NetJ8_34: J8.34 ; port SOC_CSI1.C1_LN2_P
NetJ8_35: J8.35 ; port SOC_CSI0.NC_CLK_P
NetJ8_36: J8.36 ; port SOC_CSI1.A2_LN2_M
NetJ8_39: J8.39 ; port SOC_CSI0.A2_LN2_M
NetJ8_40: J8.40 ; port SOC_CSI1.NC_CLK_P
NetJ8_41: J8.41 ; port SOC_CSI0.C1_LN2_P
NetJ8_42: J8.42 ; port SOC_CSI1.A0_CLK_M
NetJ8_45: J8.45 ; port SOC_CSI0.C2_LN3_M
NetJ8_46: J8.46 ; port SOC_CSI1.A1_LN1_P
NetJ8_47: J8.47 ; port SOC_CSI0.B2_LN3_P
NetJ8_48: J8.48 ; port SOC_CSI1.B1_LN1_M
NetJ8_52: J8.52 ; port SOC_CSI1.B0_LN0_P
NetJ8_54: J8.54 ; port SOC_CSI1.C0_LN0_M
NetJ9_1: J9.1 ; port MCU_PSSI.PC6_PSSI_D0_MDF1_CKI3
NetJ9_2: J9.2 ; port MCU_PD2_SDMMC1_CMD
NetJ9_3: J9.3 ; port MCU_PSSI.PC7_PSSI_D1_MDF1_SDI3
NetJ9_4: J9.4 ; port MCU_PE2
NetJ9_5: J9.5 ; port MCU_PSSI.PC8_PSSI_D2
NetJ9_6: J9.6 ; port MCU_PE3
NetJ9_7: J9.7 ; port MCU_PSSI.PC9_PSSI_D3
NetJ9_8: J9.8 ; port MCU_PE5
NetJ9_9: J9.9 ; port MCU_PSSI.PE4_PSSI_D4_TRACED1
NetJ9_10: J9.10 ; port MCU_PE6
NetJ9_11: J9.11 ; port MCU_PSSI.PI4_PSSI_D5
NetJ9_12: J9.12 ; port MCU_PE7
NetJ9_13: J9.13 ; port MCU_PSSI.PI6_PSSI_D6
NetJ9_14: J9.14 ; port MCU_PE8
NetJ9_15: J9.15 ; port MCU_PSSI.PI7_PSSI_D7
NetJ9_17: J9.17 ; port MCU_PSSI.PD9_PSSI_PDCK
NetJ9_19: J9.19 ; port MCU_PSSI.PI5_PSSI_RDY
NetJ9_20: J9.20 ; port MCU_OPAMP1.PA3_VOUT
NetJ9_21: J9.21 ; port MCU_PSSI.PD8_PSSI_DE
NetJ9_22: J9.22 ; port MCU_OPAMP1.PA0_VINP
NetJ9_23: J9.23 ; port MCU_PA8_MCO
NetJ9_24: J9.24 ; port MCU_OPAMP1.PA1_VINM
NetJ9_25: J9.25 ; port MCU_PA10_CRS_SYNCH
NetJ9_37: J9.37 ; port SOC_SE0.GPIO_0 SE0: MISO / CTS / SDA
NetJ9_39: J9.39 ; port SOC_SE0.GPIO_1 SE0: MOSI / RFR / SCL
NetJ9_41: J9.41 ; port SOC_SE0.GPIO_2 SE0: SCLK / TX
NetJ9_43: J9.43 ; port SOC_SE0.GPIO_3 SE0: CS_N_0 / RX
NetJ9_45: J9.45 ; port SOC_SE0.GPIO_86 SE0: CS_N_2
NetJ9_46: J9.46 ; port SOC_MI2S0.GPIO_98_DMIC1_CLK / MI2S0_CLK
NetJ9_47: J9.47 ; port SOC_SE0.GPIO_82 SE0: CS_N_1 / PWM[6]
NetJ9_48: J9.48 ; port SOC_MI2S0.GPIO_99_DMIC1_DATA / MI2S0_WS
NetJ9_49: J9.49 ; port SOC_PWM.GPIO_18_PWM[0]
NetJ9_50: J9.50 ; port SOC_MI2S0.GPIO_100_DMIC2_CLK / MI2S0_DATA0
NetJ9_51: J9.51 ; port SOC_PWM.GPIO_28_PWM[1]
NetJ9_52: J9.52 ; port SOC_MI2S0.GPIO_101_DMIC2_DATA / MI2S0_DATA1 / MI2S_MCLK1_B

### Notes on the sheet
- JMEDIA
- JMISC
- Title:
- ID:
- Date:
- Time:
- Version:
- Sheet
- of
- RevAuthor:
- Reference Designs ARE PROVIDED "AS IS" AND "WITH ALL FAULTS. Arduino SA DISCLAIMS ALL OTHER WARRANTIES, EXPRESS OR IMPLIED, REGARDING PRODUCTS, INCLUDING BUT NOT LIMITED TO, ANY IMPLIED WARRANTIES OF MERCHANTABILITY OR FITNESS FOR A PARTICULAR PURPOSE.
  Arduino SA may make changes to specifications and product descriptions at any time, without notice. The Customer must not rely on the absence or characteristics of any features or instructions marked "reserved" or "undefined".
  Arduino SA reserves these for future definition and shall have no responsibility whatsoever for conflicts or incompatibilities arising from future changes to them. The product information on the Web Site or Materials is subject to change without notice.
  Do not finalize a design with this info. ARDUINO and other Arduino brands and logos and Trademarks of Arduino SA. All Arduino SA Trademarks cannot be used without owner's formal permission.
- File:
- Author:

### Library data of the parts
J8 J9 = J0575-A.2: CONN HEADER FEMALE VERTICAL SMD 1.27mm 2x30 POS heigth 4.6mm FIXING PINS; Manufacturer: Greenconn; Code Arduino: J0575; Part Number: CSEC202-3002C004C1AF

## Sheet EXPANDER_I2C.SchDoc: EXPANDER I2C
size A4; Author: Silvio Navaretti; CompanyName: Arduino SRL; DrawnBy: Silvio Navaretti; Engineer: Silvio Navaretti; Organization: Arduino SRL; DocumentNumber: ASX00083; SheetNumber: 5; SheetTotal: 11; RevAuthor: Silvio Navaretti
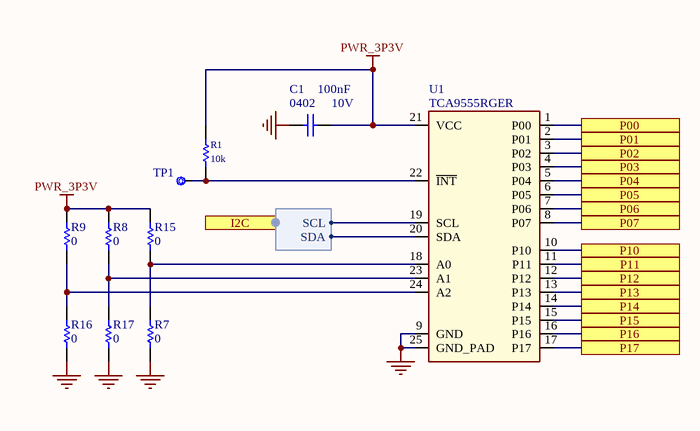
[diagram p9: EXPANDER_I2C.SchDoc]

### Parts
C1  value 100nF  Case Code (Imperial): 0402  Voltage: 10V  [CAP-0402]  (hidden comment: GRM155R61A104KA01J)
R1  value 10k  [RES-0402]  (hidden comment: CRCW040210K0FKED)
R7  value 0  [RES-0402]  (hidden comment: CRCW04020000Z0EDC)
R8  value 0  [RES-0402]  (hidden comment: CRCW04020000Z0EDC)
R9  value 0  [RES-0402]  (hidden comment: CRCW04020000Z0EDC)
R15  value 0  [RES-0402]  (hidden comment: CRCW04020000Z0EDC)
R16  value 0  [RES-0402]  (hidden comment: CRCW04020000Z0EDC)
R17  value 0  [RES-0402]  (hidden comment: CRCW04020000Z0EDC)
TP1  Test point 1.00mm  [TP-1.00MM]  (value not drawn)  (no BOM)
U1  TCA9555RGER  [PQFN50P400X400X100_HS-25N]

### Ports
I2C (harness I2C), P00, P01, P02, P03, P04, P05, P06, P07, P10, P11, P12, P13, P14, P15, P16, P17

### Harnesses
I2C: SDA, SCL

### Nets
GND: C1.1 R7.2 R16.2 R17.2 U1.9(GND) U1.25(GND_PAD)
PWR_3P3V: C1.2 R1.2 R8.1 R9.1 R15.1 U1.21(VCC)
NetJ3_1_17: U1.3(P02) ; port P02
NetJ3_1_18: U1.4(P03) ; port P03
NetJ3_2_17: U1.1(P00) ; port P00
NetJ3_2_18: U1.2(P01) ; port P01
NetJ3_2_20: U1.19(SCL) ; port I2C.SCL
NetJ3_2_21: U1.20(SDA) ; port I2C.SDA
NetR1_1: R1.1 TP1.X U1.22(~{INT})
NetR2_1_1: U1.5(P04) ; port P04
NetR2_2_1: U1.8(P07) ; port P07
NetR2_3_1: U1.12(P12) ; port P12
NetR2_4_1: U1.15(P15) ; port P15
NetR4_1_1: U1.6(P05) ; port P05
NetR4_2_1: U1.10(P10) ; port P10
NetR4_3_1: U1.13(P13) ; port P13
NetR4_4_1: U1.16(P16) ; port P16
NetR5_1_2: U1.7(P06) ; port P06
NetR5_2_2: U1.11(P11) ; port P11
NetR5_3_2: U1.14(P14) ; port P14
NetR5_4_2: U1.17(P17) ; port P17
NetR7_1: R7.1 R15.2 U1.18(A0)
NetR8_2: R8.2 R17.1 U1.23(A1)
NetR9_2: R9.2 R16.1 U1.24(A2)

### Notes on the sheet
- Title:
- ID:
- Date:
- Time:
- Version:
- Sheet
- of
- RevAuthor:
- Reference Designs ARE PROVIDED "AS IS" AND "WITH ALL FAULTS. Arduino SA DISCLAIMS ALL OTHER WARRANTIES, EXPRESS OR IMPLIED, REGARDING PRODUCTS, INCLUDING BUT NOT LIMITED TO, ANY IMPLIED WARRANTIES OF MERCHANTABILITY OR FITNESS FOR A PARTICULAR PURPOSE.
  Arduino SA may make changes to specifications and product descriptions at any time, without notice. The Customer must not rely on the absence or characteristics of any features or instructions marked "reserved" or "undefined". Arduino SA reserves these for future definition and shall have no responsibility whatsoever for conflicts or incompatibilities arising from future changes to them. The product information on the Web Site or Materials is subject to change without notice.
  Do not finalize a design with this info. ARDUINO and other Arduino brands and logos and Trademarks of Arduino SA. All Arduino SA Trademarks cannot be used without owner's formal permission.
- File:
- Author:

### Library data of the parts
C1 = C0134-A.4: CAP CHIP 0402 100nF 10% 10V X5R; Manufacturer: Murata; Code Arduino: C0134; Part Number: GRM155R61A104KA01J; Technology: Ceramic; Manufacturer 2: Walsin; Tolerance: 10%; Dielectric: X5R
R1 = R0003-A.24: as R20 on sheet TRANSLATOR_I2C; Case Code (Imperial): 0402; Part Number: CRCW040210K0FKED; Technology: Thick film; Tolerance: 1%
R7-R9 R15-R17 = R0000-A.24: as R6 on sheet AUDIO_EAR; Part Number: CRCW04020000Z0EDC; Technology: Thick film; Case Code (Imperial): 0402
TP1 = UT0013-A.6: Manufacturer: This is not a component; Source: ut.SchLib; Pin Count: 1; Design Item ID: CMP-018-0005-A.3; Part Number: This is not a component; Code Arduino: This is not a component
U1 = U0167-A.6: IC 16b I2C EXPANDER with INTERRUPT; Manufacturer: Texas Instruments; Code Arduino: U0167; Part Number: TCA9555RGER; LCSC Part #: C2869248